# Altium project PCB_Project1.PrjPCB
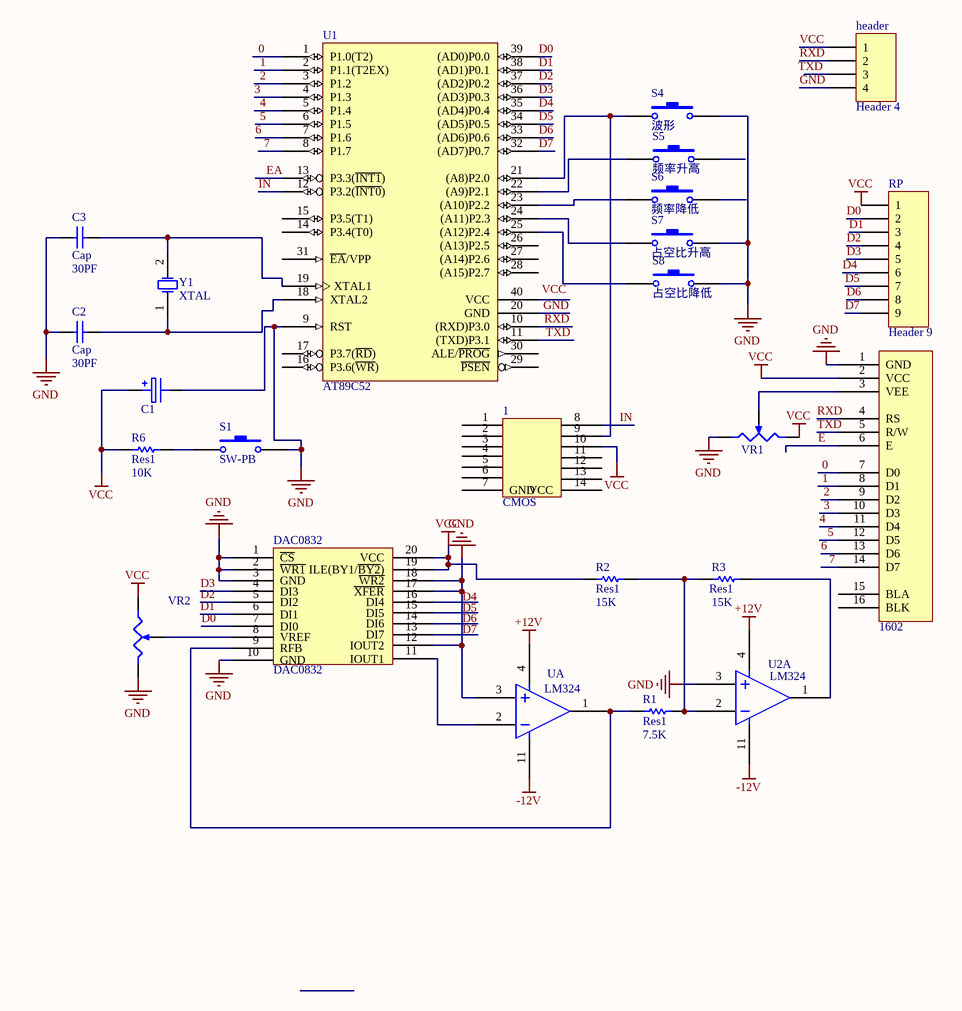
[diagram p0: 原理图.SchDoc]
1 sheet, 24 parts. Net scope: global (net labels, ports and power ports of the same name join across sheets).
Board file: LAST.PcbDoc

## Sheet 原理图.SchDoc
size A4

### Parts
1  CMOS  [DIP-14N]
C1  CAP-E  [EC-10]  (value not drawn)
C2  Cap  value 30PF  [RAD-0.3]
C3  Cap  value 30PF  [RAD-0.3]
DAC0832  DAC0832  [DAC0832LCN]
header  Header 4  [HDR1X4]
R1  Res1  value 7.5K  [AXIAL-0.3]
R2  Res1  value 15K  [AXIAL-0.3]
R3  Res1  value 15K  [AXIAL-0.3]
R6  Res1  value 10K  [AXIAL-0.3]
RP  Header 9  [HDR1X9]
S1  SW-PB  [SPST-2]
S4  波形  [SPST-2]
S5  频率升高  [SPST-2]
S6  频率降低  [SPST-2]
S7  占空比升高  [SPST-2]
S8  占空比降低  [SPST-2]
U  LM324  [DIP-14]  (part A of 4)
U1  AT89C52  [DIP40]
U2  LM324  [DIP-14]  (part A of 4)
VR1  RES-V  [HDR1X3]  (value not drawn)
VR2  RES-V  [HDR1X3]  (value not drawn)
Y1  XTAL  [R38]
  1602  [SIP16]

### Nets
+12V: U.4 U2.4
-12V: U.11 U2.11
D4: C1.2 C2.1 C3.1 DAC0832.1(~{CS}) DAC0832.2(~{WR1}) DAC0832.3(GND) DAC0832.10(GND) DAC0832.12(IOUT2) DAC0832.17(~{XFER}) DAC0832.18(~{WR2}) header.4 RP.6 RP.7 RP.8 RP.9 S1.2 S4.2 S7.2 S8.2 U.3 U1.9(RST) U1.20(GND) U1.32((AD7)P0.7) U1.33((AD6)P0.6) U1.34((AD5)P0.5) U1.35((AD4)P0.4) U2.3 VR1.1(BOT) VR2.3(TOP) .1(GND)  [also labelled D5, D6, D7, GND]
VCC: 1.10 C1.1 DAC0832.19(ILE(BY1/~{BY2})) DAC0832.20(VCC) header.1 R2.1 R6.1 RP.1 VR1.3(TOP) VR2.1(BOT) .2(VCC)
0: U1.1(P1.0(T2)) .7(D0)
1: U1.2(P1.1(T2EX)) .8(D1)
2: U1.3(P1.2) .9(D2)
3: U1.4(P1.3) .10(D3)
4: U1.5(P1.4) .11(D4)
5: U1.6(P1.5) .12(D5)
6: U1.7(P1.6) .13(D6)
7: U1.8(P1.7) .14(D7)
D0: DAC0832.7(DI0) RP.2 U1.39((AD0)P0.0)
D1: DAC0832.6(DI1) RP.3 U1.38((AD1)P0.1)
D2: DAC0832.5(DI2) RP.4 U1.37((AD2)P0.2)
D3: DAC0832.4(DI3) RP.5 U1.36((AD3)P0.3)
E: .6(E)
EA: U1.13(P3.3(~{INT1}))
IN: 1.8 U1.12(P3.2(~{INT0}))
RXD: header.2 U1.10((RXD)P3.0) .4(RS)
TXD: U1.11((TXD)P3.1) .5(R/W)
Net1_9: 1.9 S4.1 U1.21((A8)P2.0)
NetC2_2: C2.2 U1.18(XTAL2) Y1.1(OSC1)
NetC3_2: C3.2 U1.19(XTAL1) Y1.2(OSC2)
NetDAC0832_8: DAC0832.8(VREF) VR2.2(TAP)
NetDAC0832_9: DAC0832.9(RFB) R1.1 U.1
NetDAC0832_11: DAC0832.11(IOUT1) U.2
NetR1_2: R1.2 R2.2 R3.1 U2.2
NetR3_2: R3.2 U2.1
NetR6_2: R6.2 S1.1
NetS5_1: S5.1 U1.22((A9)P2.1)
NetS6_1: S6.1 U1.23((A10)P2.2)
NetS7_1: S7.1 U1.24((A11)P2.3)
NetS8_1: S8.1 U1.25((A12)P2.4)
NetVR1_2: VR1.2(TAP) .3(VEE)

Not connected (* = marked no-connect by the designer): 1 1 2 3 4 5 6 7(GND) 11 12 13 14(VCC); DAC0832 13(DI7) 14(DI6) 15(DI5) 16(DI4); header 3; S5 2; S6 2; U1 14(P3.4(T0)) 15(P3.5(T1)) 16(P3.6(~{WR})) 17(P3.7(~{RD})) 26((A13)P2.5) 27((A14)P2.6) 28((A15)P2.7) 29(~{PSEN}) 30(ALE/~{PROG}) 31(~{EA}/VPP) 40(VCC);  15(BLA) 16(BLK)

### Notes on the sheet
- Labels drawn without touching a wire or pin: TXD, VCC

### Library data of the parts
C1 = CAP-E: 电解电容
C2 C3 = Cap: Capacitor; Published: 8-Jun-2000; LatestRevisionDate: 17-Jul-2002; LatestRevisionNote: Re-released for DXP Platform.; PackageReference: RAD-0.3; Publisher: Altium Limited; PackageDescription: Radial Cap, Thru-Hole; 2 Leads; 0.3 in Pin Spacing
header = Header 4: Header, 4-Pin; LatestRevisionDate: 17-Jul-2002; LatestRevisionNote: Re-released for DXP Platform.; Publisher: Altium Limited
R1-R3 R6 = Res1: Resistor; Published: 8-Jun-2000; LatestRevisionDate: 17-Jul-2002; LatestRevisionNote: Re-released for DXP Platform.; PackageReference: AXIAL-0.3; Publisher: Altium Limited; PackageDescription: Axial Device, Thru-Hole; 2 Leads; 0.3 in Pin Spacing
RP = Header 9: Header, 9-Pin; LatestRevisionDate: 17-Jul-2002; LatestRevisionNote: Re-released for DXP Platform.; Publisher: Altium Limited
S1 S4-S8 = SW-PB: Switch; Published: 24-Mar-1999; LatestRevisionDate: 17-Jul-2002; LatestRevisionNote: Re-released for DXP Platform.; PackageReference: SPST-2; Publisher: Altium Limited; PackageDescription: Switch; 2 Leads
U1 = AT89C52: 8-Bit Microcontroller with 8K Flash ROM
VR1 VR2 = RES-V: Potentiometer
Y1 = XTAL: Crystal Oscillator; Published: 8-Jun-2000; LatestRevisionDate: 17-Jul-2002; LatestRevisionNote: Re-released for DXP Platform.; PackageReference: R38; Publisher: Altium Limited; PackageDescription: Crystal, Thru-Hole; 2 Leads; Body 3.1 x 8.2 mm (Dia.xH)